# EAGLE schematic miniPET_final (EAGLE 9.6.2)

## Sheet 1 of 7
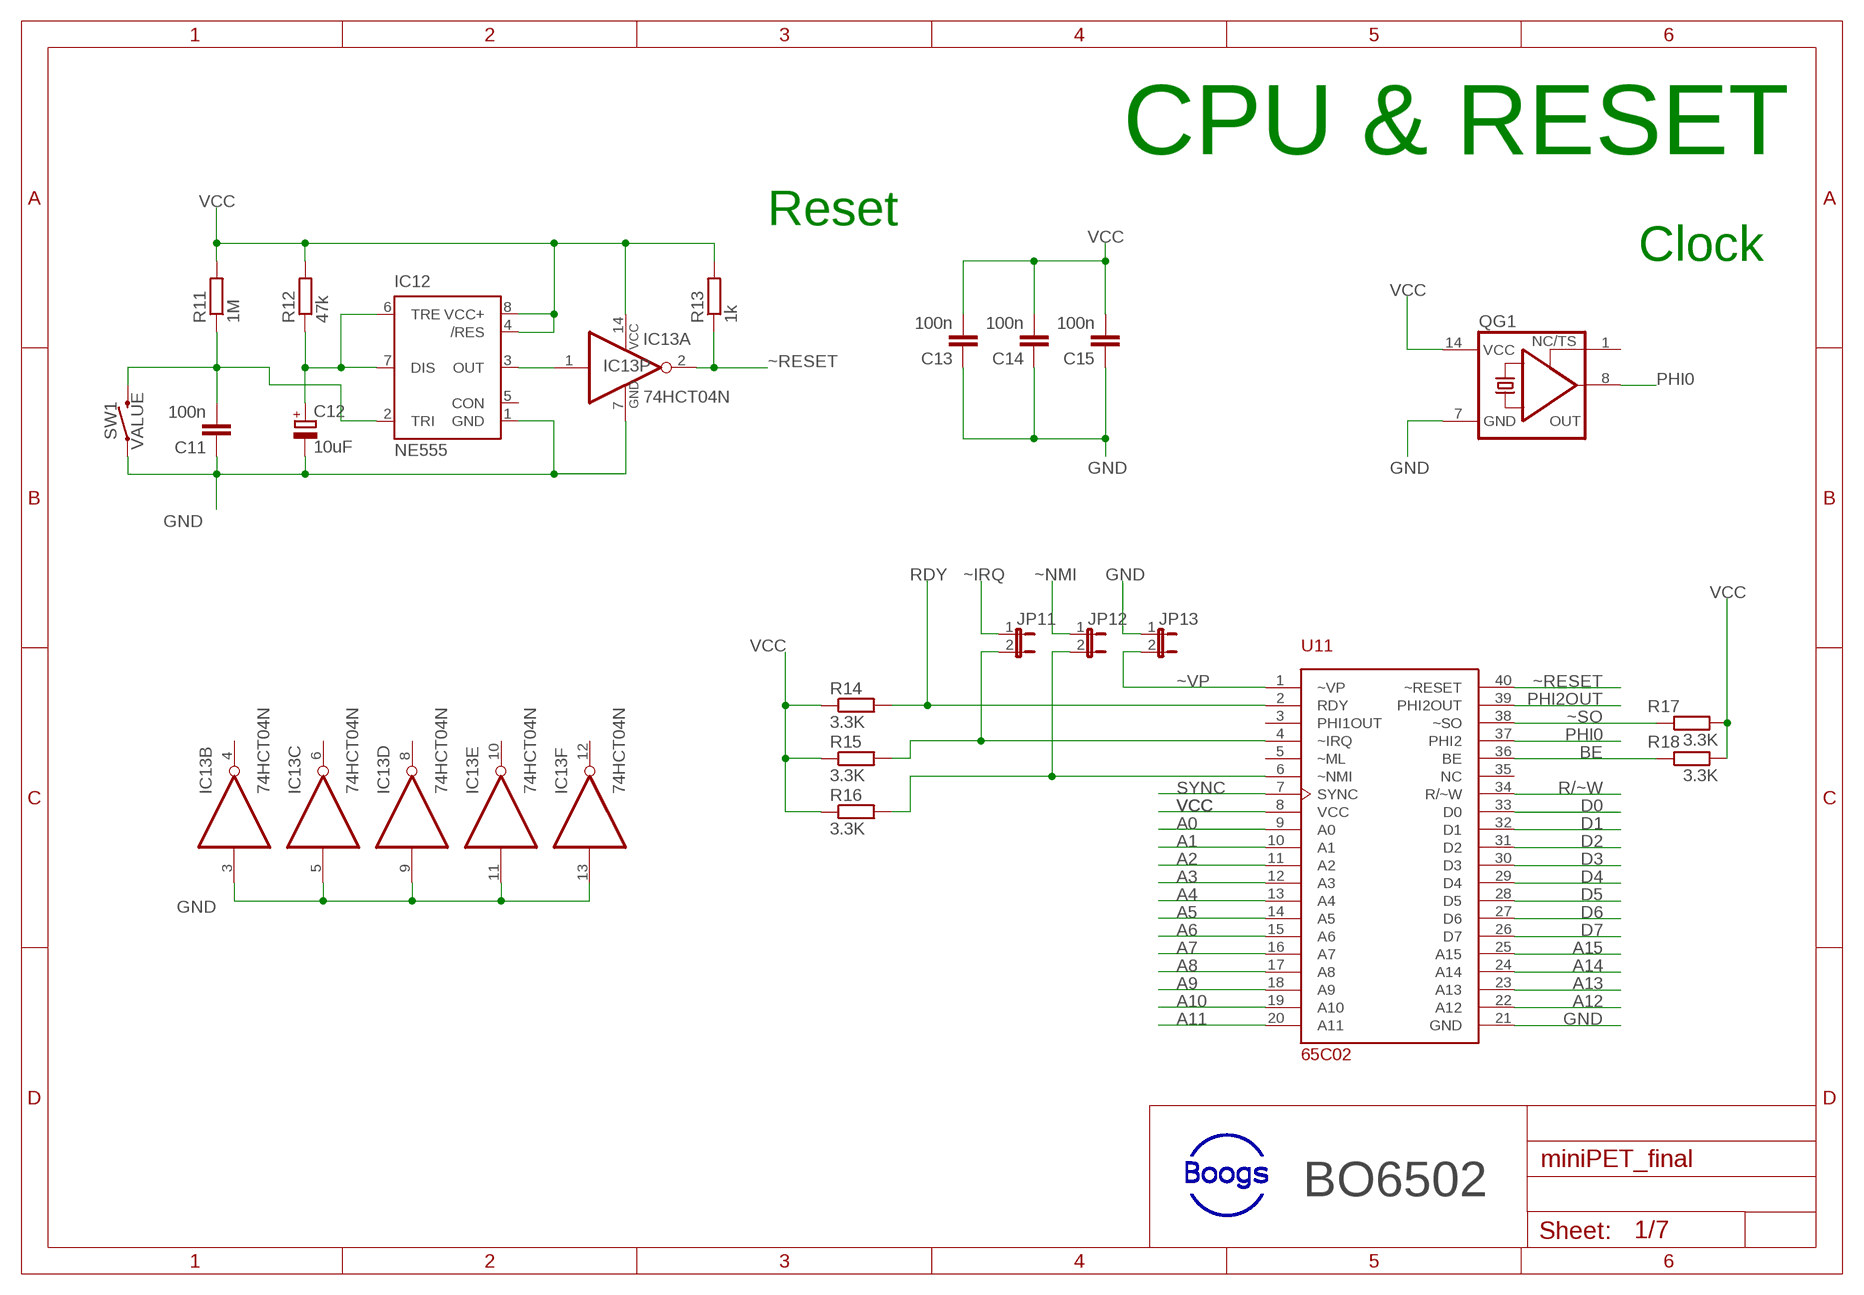
[diagram p0: schematic, sheet 1]

### Parts
C11  100n  C-EU025-025X050  [C025-025X050]
C12  10uF  CPOL-EUB45181A  [B45181A]
C13  100n  C-EU025-025X050  [C025-025X050]
C14  100n  C-EU025-025X050  [C025-025X050]
C15  100n  C-EU025-025X050  [C025-025X050]
IC12  NE555  [DIL-08]
IC13  74HCT04N  [DIL14]
JP11  JP1E  [JP1]
JP12  JP1E  [JP1]
JP13  JP1E  [JP1]
QG1  XO-14  [DIL14S]
R11  1M  R-EU_0207/10  [0207/10]
R12  47k  R-EU_0207/10  [0207/10]
R13  1k  R-EU_0207/10  [0207/10]
R14  3.3K  R-EU_0207/10  [0207/10]
R15  3.3K  R-EU_0207/10  [0207/10]
R16  3.3K  R-EU_0207/10  [0207/10]
R17  3.3K  R-EU_0207/10  [0207/10]
R18  3.3K  R-EU_0207/10  [0207/10]
SW1  MOMENTARY-SWITCH-SPST-PTH-RIGHT-ANGLE-8-020  [TACTILE_SWITCH_PTH_RA_8-020]
U11  65C02  [DIL40]

### Nets
A0: U11.9(A0) ; also sheet 2,3,4,5,6,7
A1: U11.10(A1) ; also sheet 2,3,4,5,6,7
A2: U11.11(A2) ; also sheet 2,3,5,6,7
A3: U11.12(A3) ; also sheet 2,3,5,6,7
A4: U11.13(A4) ; also sheet 2,3,5,7
A5: U11.14(A5) ; also sheet 2,3,5,7
A6: U11.15(A6) ; also sheet 2,3,5,7
A7: U11.16(A7) ; also sheet 2,3,5,7
A8: U11.17(A8) ; also sheet 2,3,5,6,7
A9: U11.18(A9) ; also sheet 2,3,5,6,7
A10: U11.19(A10) ; also sheet 2,3,5,6,7
A11: U11.20(A11) ; also sheet 2,3,5,6,7
A12: U11.22(A12) ; also sheet 2,3,4,5,7
A13: U11.23(A13) ; also sheet 2,3,4,5,7
A14: U11.24(A14) ; also sheet 2,3,4,5,6,7
A15: U11.25(A15) ; also sheet 2,3,4,5,7
BE: R18.1 U11.36(BE)
D0: U11.33(D0) ; also sheet 2,3,4,5,6,7
D1: U11.32(D1) ; also sheet 2,3,4,5,6,7
D2: U11.31(D2) ; also sheet 2,3,4,5,6,7
D3: U11.30(D3) ; also sheet 2,3,4,5,6,7
D4: U11.29(D4) ; also sheet 2,3,4,5,6,7
D5: U11.28(D5) ; also sheet 2,3,4,5,6,7
D6: U11.27(D6) ; also sheet 2,3,4,5,6,7
D7: U11.26(D7) ; also sheet 2,3,4,5,6,7
GND: C11.1 C12.- C13.1 C14.1 C15.1 IC12.1(GND) IC13.3(B:I) IC13.5(C:I) IC13.7(P:GND) IC13.9(D:I) IC13.11(E:I) IC13.13(F:I) JP13.1 QG1.7(GND) SW1.1 U11.21(GND) ; also sheet 2,3,4,5,6,7
N$2: JP11.2 R15.2 U11.4(~IRQ)
N$3: JP12.2 R16.2 U11.6(~NMI)
N$44: C12.+ IC12.6(TRE) IC12.7(DIS) R12.1
N$45: C11.2 IC12.2(TRI) R11.1 SW1.2
N$46: IC12.3(OUT) IC13.1(A:I)
PHI0: QG1.8(OUT) U11.37(PHI2) ; also sheet 2,4,5,6,7
PHI2OUT: U11.39(PHI2OUT)
R/~W: U11.34(R/~W) ; also sheet 2,4,5,6
RDY: R14.2 U11.2(RDY)
SYNC: U11.7(SYNC)
VCC: C13.2 C14.2 C15.2 IC12.4(/RES) IC12.8(VCC+) IC13.14(P:VCC) QG1.14(VCC) R11.2 R12.2 R13.2 R14.1 R15.1 R16.1 R17.2 R18.2 U11.8(VCC) ; also sheet 2,3,4,5,6,7
~IRQ: JP11.1 ; also sheet 4,5,6
~NMI: JP12.1
~RESET: IC13.2(A:O) R13.1 U11.40(~RESET) ; also sheet 4,5,6
~SO: R17.1 U11.38(~SO)
~VP: JP13.2 U11.1(~VP)
Unconnected: IC12.5(CON) IC13.4(B:O) IC13.6(C:O) IC13.8(D:O) IC13.10(E:O) IC13.12(F:O) QG1.1(TS) U11.3(PHI1OUT) U11.5(~ML) U11.35(NC)

### Notes on the sheet
- CPU & RESET
- Reset
- Clock
- BO6502

## Sheet 2 of 7
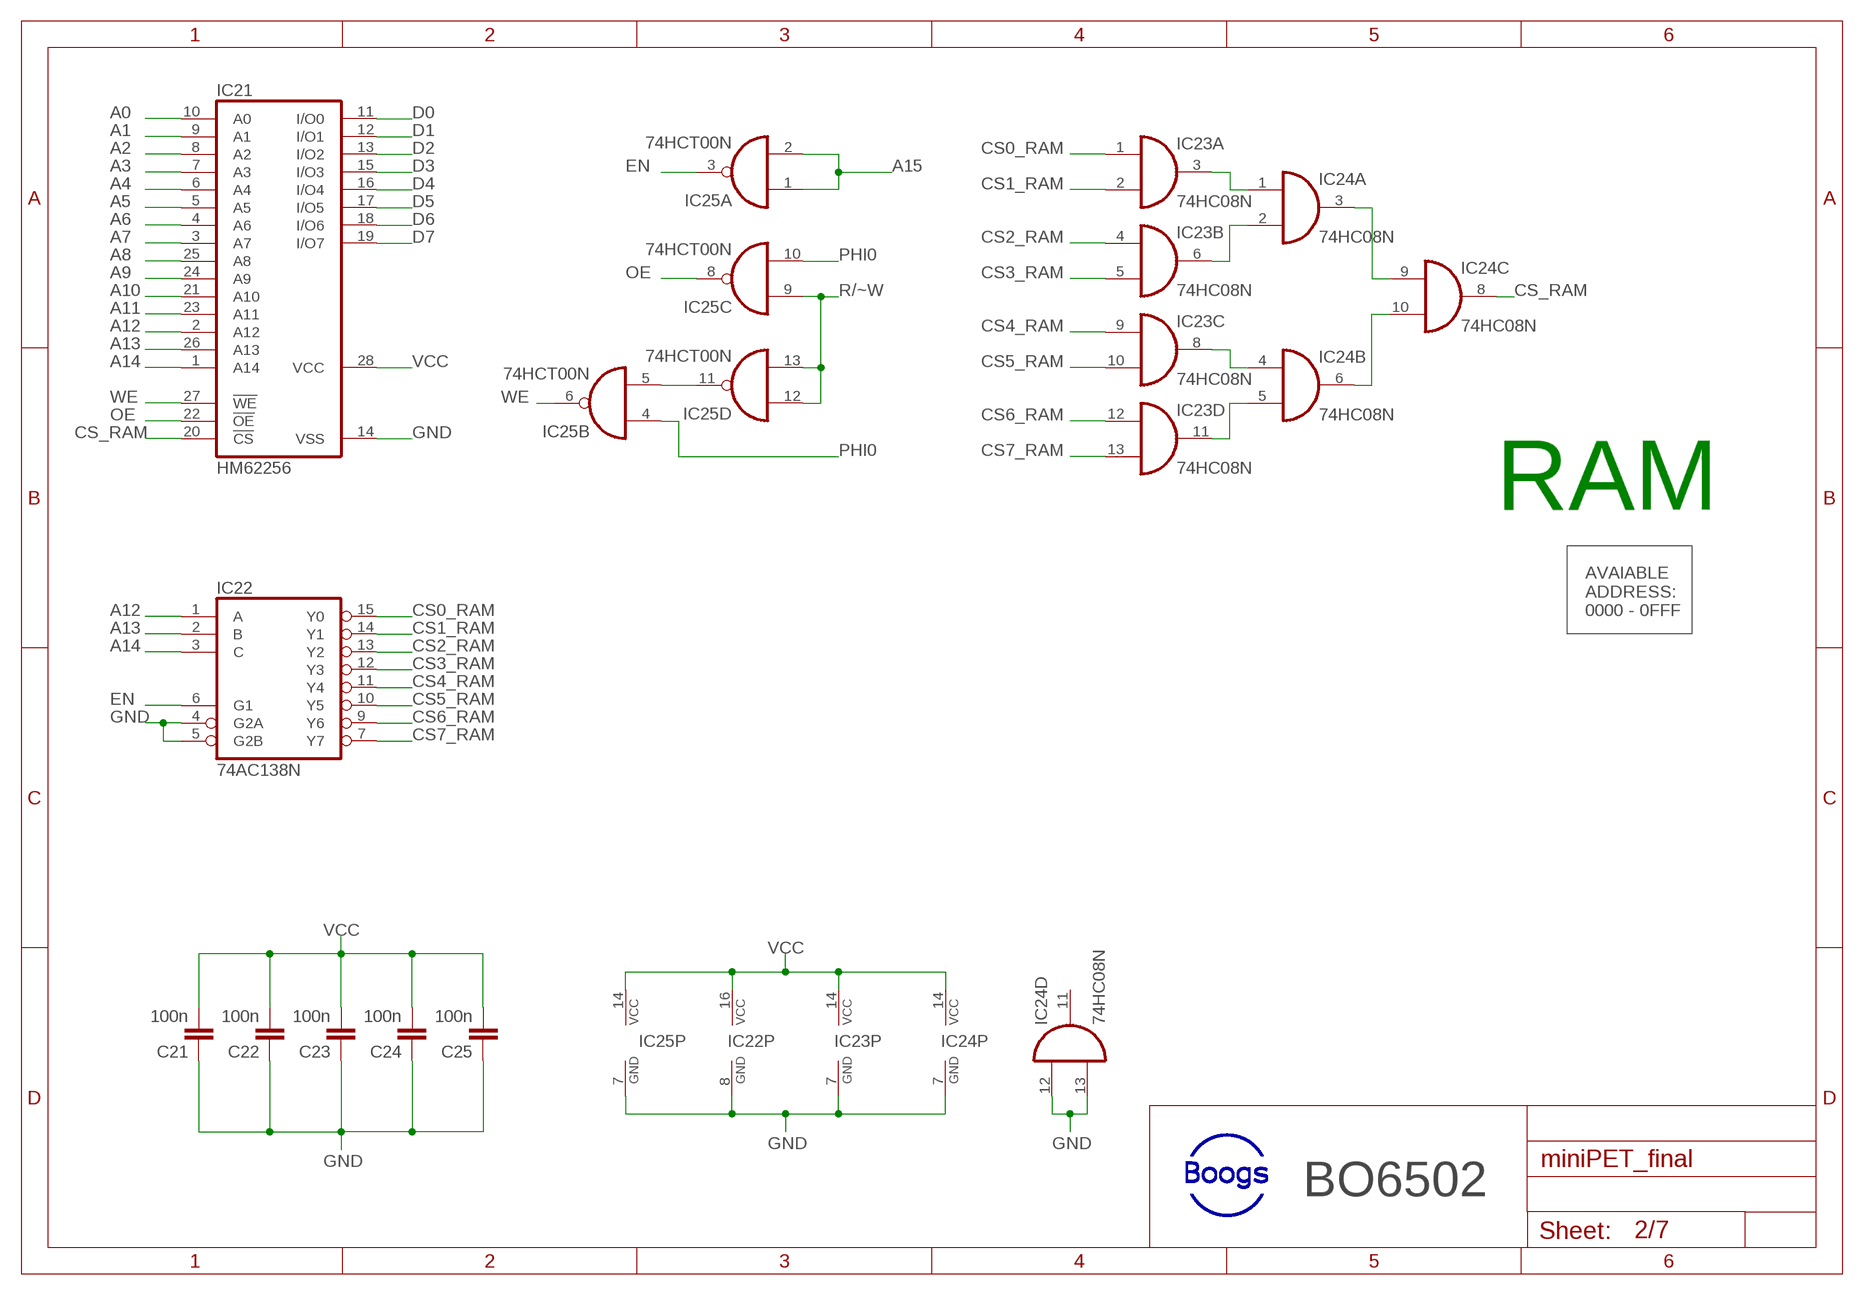
[diagram p1: schematic, sheet 2]

### Parts
C21  100n  C-EU025-025X050  [C025-025X050]
C22  100n  C-EU025-025X050  [C025-025X050]
C23  100n  C-EU025-025X050  [C025-025X050]
C24  100n  C-EU025-025X050  [C025-025X050]
C25  100n  C-EU025-025X050  [C025-025X050]
IC21  HM62256  62256P  [DIL28-6]
IC22  74AC138N  [DIL16]
IC23  74HC08N  [DIL14]
IC24  74HC08N  [DIL14]
IC25  74HCT00N  [DIL14]

### Nets
A0: IC21.10(A0) ; also sheet 1,3,4,5,6,7
A1: IC21.9(A1) ; also sheet 1,3,4,5,6,7
A2: IC21.8(A2) ; also sheet 1,3,5,6,7
A3: IC21.7(A3) ; also sheet 1,3,5,6,7
A4: IC21.6(A4) ; also sheet 1,3,5,7
A5: IC21.5(A5) ; also sheet 1,3,5,7
A6: IC21.4(A6) ; also sheet 1,3,5,7
A7: IC21.3(A7) ; also sheet 1,3,5,7
A8: IC21.25(A8) ; also sheet 1,3,5,6,7
A9: IC21.24(A9) ; also sheet 1,3,5,6,7
A10: IC21.21(A10) ; also sheet 1,3,5,6,7
A11: IC21.23(A11) ; also sheet 1,3,5,6,7
A12: IC21.2(A12) IC22.1(A) ; also sheet 1,3,4,5,7
A13: IC21.26(A13) IC22.2(B) ; also sheet 1,3,4,5,7
A14: IC21.1(A14) IC22.3(C) ; also sheet 1,3,4,5,6,7
A15: IC25.1(A:I0) IC25.2(A:I1) ; also sheet 1,3,4,5,7
CS0_RAM: IC22.15(Y0) IC23.1(A:I0)
CS1_RAM: IC22.14(Y1) IC23.2(A:I1)
CS2_RAM: IC22.13(Y2) IC23.4(B:I0)
CS3_RAM: IC22.12(Y3) IC23.5(B:I1)
CS4_RAM: IC22.11(Y4) IC23.9(C:I0)
CS5_RAM: IC22.10(Y5) IC23.10(C:I1)
CS6_RAM: IC22.9(Y6) IC23.12(D:I0)
CS7_RAM: IC22.7(Y7) IC23.13(D:I1)
CS_RAM: IC21.20(!CS) IC24.8(C:O)
D0: IC21.11(I/O0) ; also sheet 1,3,4,5,6,7
D1: IC21.12(I/O1) ; also sheet 1,3,4,5,6,7
D2: IC21.13(I/O2) ; also sheet 1,3,4,5,6,7
D3: IC21.15(I/O3) ; also sheet 1,3,4,5,6,7
D4: IC21.16(I/O4) ; also sheet 1,3,4,5,6,7
D5: IC21.17(I/O5) ; also sheet 1,3,4,5,6,7
D6: IC21.18(I/O6) ; also sheet 1,3,4,5,6,7
D7: IC21.19(I/O7) ; also sheet 1,3,4,5,6,7
EN: IC22.6(G1) IC25.3(A:O)
GND: C21.1 C22.1 C23.1 C24.1 C25.1 IC21.14(VSS) IC22.4(G2A) IC22.5(G2B) IC22.8(GND) IC23.7(P:GND) IC24.7(P:GND) IC24.12(D:I0) IC24.13(D:I1) IC25.7(P:GND) ; also sheet 1,3,4,5,6,7
N$10: IC25.5(B:I1) IC25.11(D:O)
N$12: IC23.3(A:O) IC24.1(A:I0)
N$13: IC23.6(B:O) IC24.2(A:I1)
N$14: IC23.8(C:O) IC24.4(B:I0)
N$15: IC23.11(D:O) IC24.5(B:I1)
N$16: IC24.3(A:O) IC24.9(C:I0)
N$17: IC24.6(B:O) IC24.10(C:I1)
OE: IC21.22(!OE) IC25.8(C:O)
PHI0: IC25.4(B:I0) IC25.10(C:I1) ; also sheet 1,4,5,6,7
R/~W: IC25.9(C:I0) IC25.12(D:I0) IC25.13(D:I1) ; also sheet 1,4,5,6
VCC: C21.2 C22.2 C23.2 C24.2 C25.2 IC21.28(VCC) IC22.16(VCC) IC23.14(P:VCC) IC24.14(P:VCC) IC25.14(P:VCC) ; also sheet 1,3,4,5,6,7
WE: IC21.27(!WE) IC25.6(B:O)
Unconnected: IC24.11(D:O)

### Notes on the sheet
- RAM
- AVAIABLE 
  ADDRESS:
  0000 - 0FFF
- BO6502

## Sheet 3 of 7
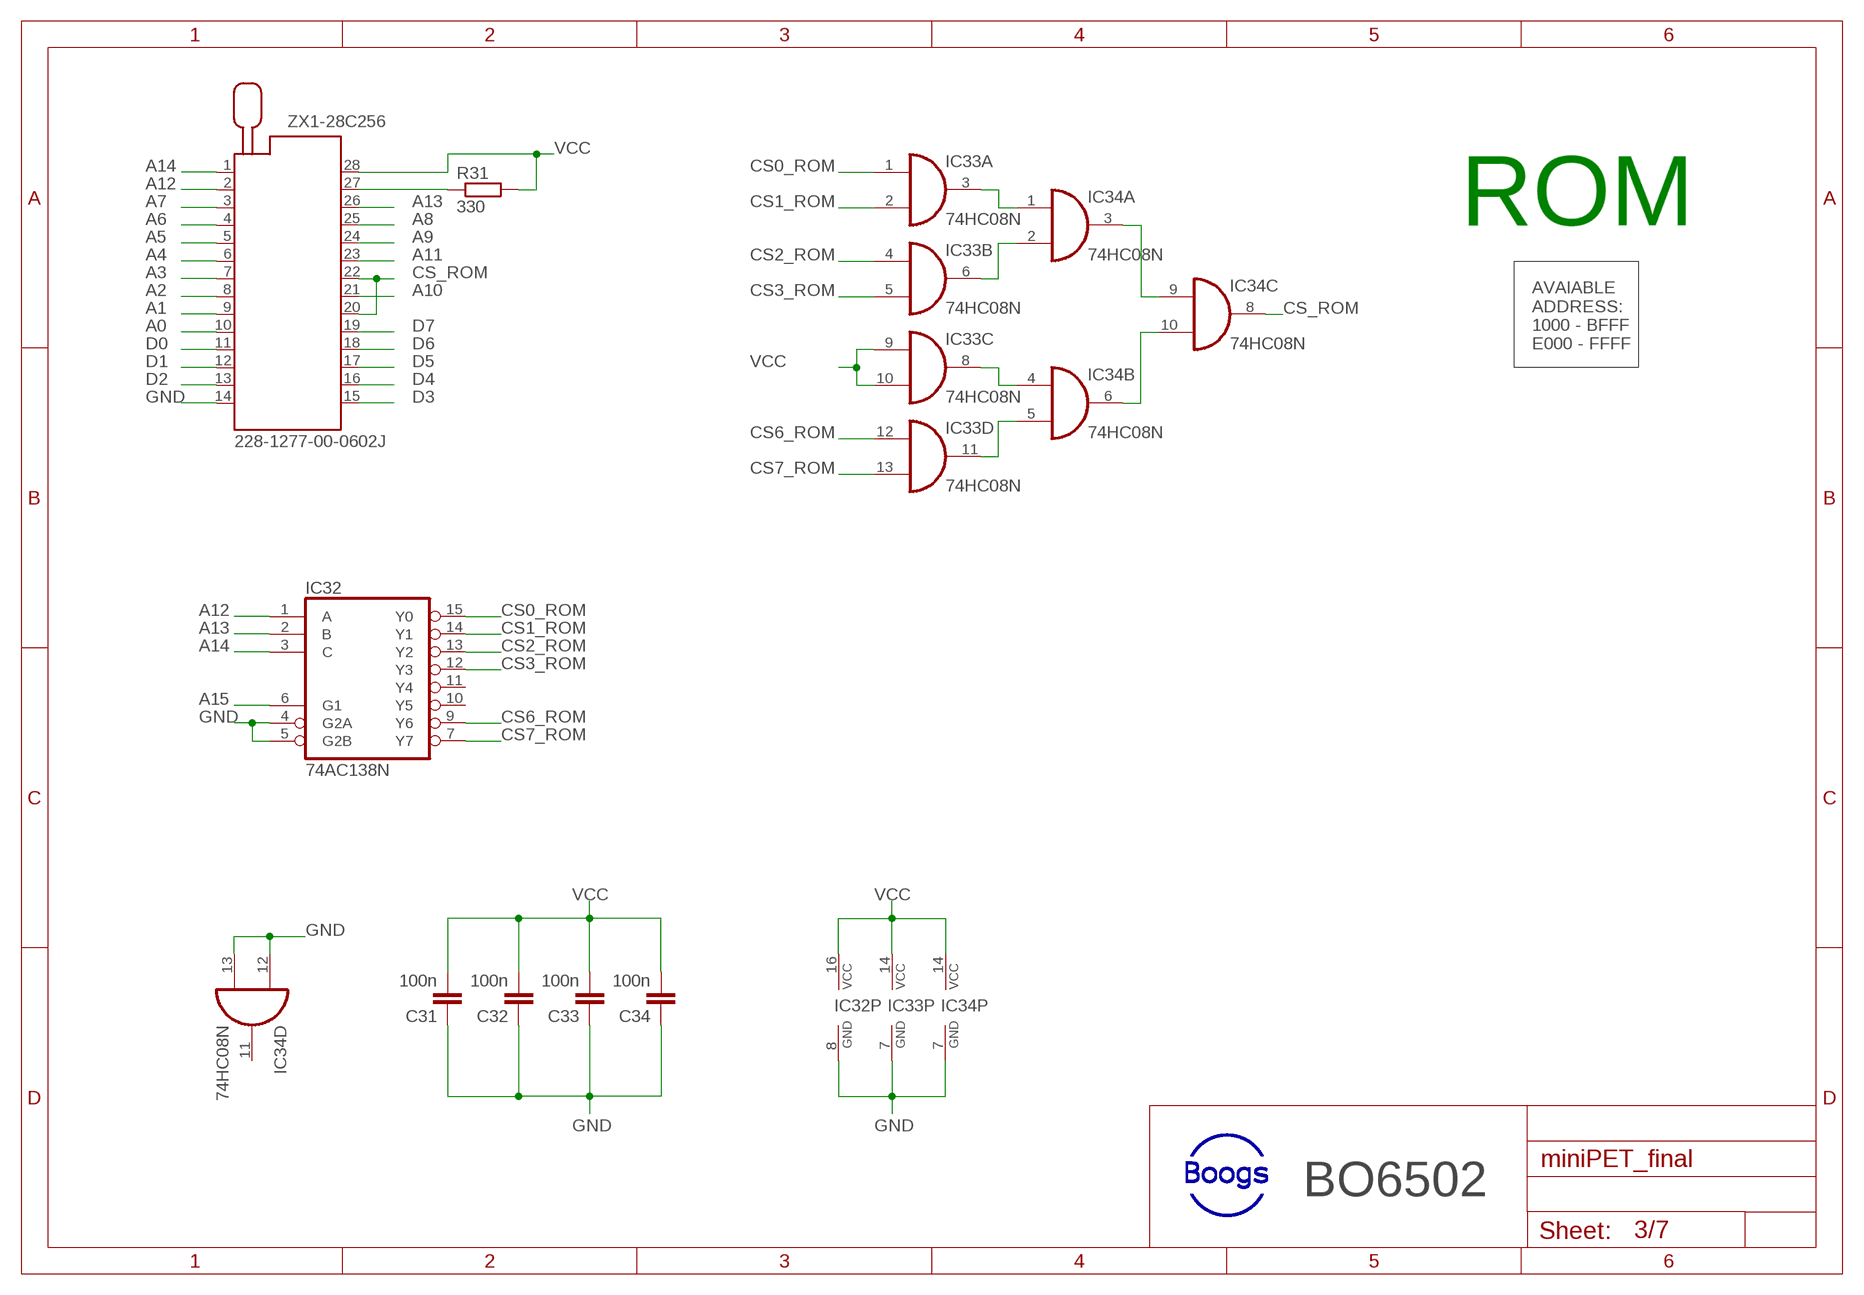
[diagram p2: schematic, sheet 3]

### Parts
C31  100n  C-EU025-025X050  [C025-025X050]
C32  100n  C-EU025-025X050  [C025-025X050]
C33  100n  C-EU025-025X050  [C025-025X050]
C34  100n  C-EU025-025X050  [C025-025X050]
IC32  74AC138N  [DIL16]
IC33  74HC08N  [DIL14]
IC34  74HC08N  [DIL14]
R31  330  R-EU_0207/10  [0207/10]
ZX1-28C256  228-1277-00-0602J  [228-1277-00-0602J]

### Nets
A0: ZX1-28C256.10 ; also sheet 1,2,4,5,6,7
A1: ZX1-28C256.9 ; also sheet 1,2,4,5,6,7
A2: ZX1-28C256.8 ; also sheet 1,2,5,6,7
A3: ZX1-28C256.7 ; also sheet 1,2,5,6,7
A4: ZX1-28C256.6 ; also sheet 1,2,5,7
A5: ZX1-28C256.5 ; also sheet 1,2,5,7
A6: ZX1-28C256.4 ; also sheet 1,2,5,7
A7: ZX1-28C256.3 ; also sheet 1,2,5,7
A8: ZX1-28C256.25 ; also sheet 1,2,5,6,7
A9: ZX1-28C256.24 ; also sheet 1,2,5,6,7
A10: ZX1-28C256.21 ; also sheet 1,2,5,6,7
A11: ZX1-28C256.23 ; also sheet 1,2,5,6,7
A12: IC32.1(A) ZX1-28C256.2 ; also sheet 1,2,4,5,7
A13: IC32.2(B) ZX1-28C256.26 ; also sheet 1,2,4,5,7
A14: IC32.3(C) ZX1-28C256.1 ; also sheet 1,2,4,5,6,7
A15: IC32.6(G1) ; also sheet 1,2,4,5,7
CS0_ROM: IC32.15(Y0) IC33.1(A:I0)
CS1_ROM: IC32.14(Y1) IC33.2(A:I1)
CS2_ROM: IC32.13(Y2) IC33.4(B:I0)
CS3_ROM: IC32.12(Y3) IC33.5(B:I1)
CS6_ROM: IC32.9(Y6) IC33.12(D:I0)
CS7_ROM: IC32.7(Y7) IC33.13(D:I1)
CS_ROM: IC34.8(C:O) ZX1-28C256.20 ZX1-28C256.22
D0: ZX1-28C256.11 ; also sheet 1,2,4,5,6,7
D1: ZX1-28C256.12 ; also sheet 1,2,4,5,6,7
D2: ZX1-28C256.13 ; also sheet 1,2,4,5,6,7
D3: ZX1-28C256.15 ; also sheet 1,2,4,5,6,7
D4: ZX1-28C256.16 ; also sheet 1,2,4,5,6,7
D5: ZX1-28C256.17 ; also sheet 1,2,4,5,6,7
D6: ZX1-28C256.18 ; also sheet 1,2,4,5,6,7
D7: ZX1-28C256.19 ; also sheet 1,2,4,5,6,7
GND: C31.1 C32.1 C33.1 C34.1 IC32.4(G2A) IC32.5(G2B) IC32.8(GND) IC33.7(P:GND) IC34.7(P:GND) IC34.12(D:I0) IC34.13(D:I1) ZX1-28C256.14 ; also sheet 1,2,4,5,6,7
N$1: R31.1 ZX1-28C256.27
N$28: IC33.3(A:O) IC34.1(A:I0)
N$29: IC33.6(B:O) IC34.2(A:I1)
N$30: IC33.8(C:O) IC34.4(B:I0)
N$31: IC33.11(D:O) IC34.5(B:I1)
N$32: IC34.3(A:O) IC34.9(C:I0)
N$33: IC34.6(B:O) IC34.10(C:I1)
VCC: C31.2 C32.2 C33.2 C34.2 IC32.16(VCC) IC33.9(C:I0) IC33.10(C:I1) IC33.14(P:VCC) IC34.14(P:VCC) R31.2 ZX1-28C256.28 ; also sheet 1,2,4,5,6,7
Unconnected: IC32.10(Y5) IC32.11(Y4) IC34.11(D:O)

### Notes on the sheet
- ROM
- AVAIABLE 
  ADDRESS:
  1000 - BFFF
  E000 - FFFF
- BO6502

## Sheet 4 of 7
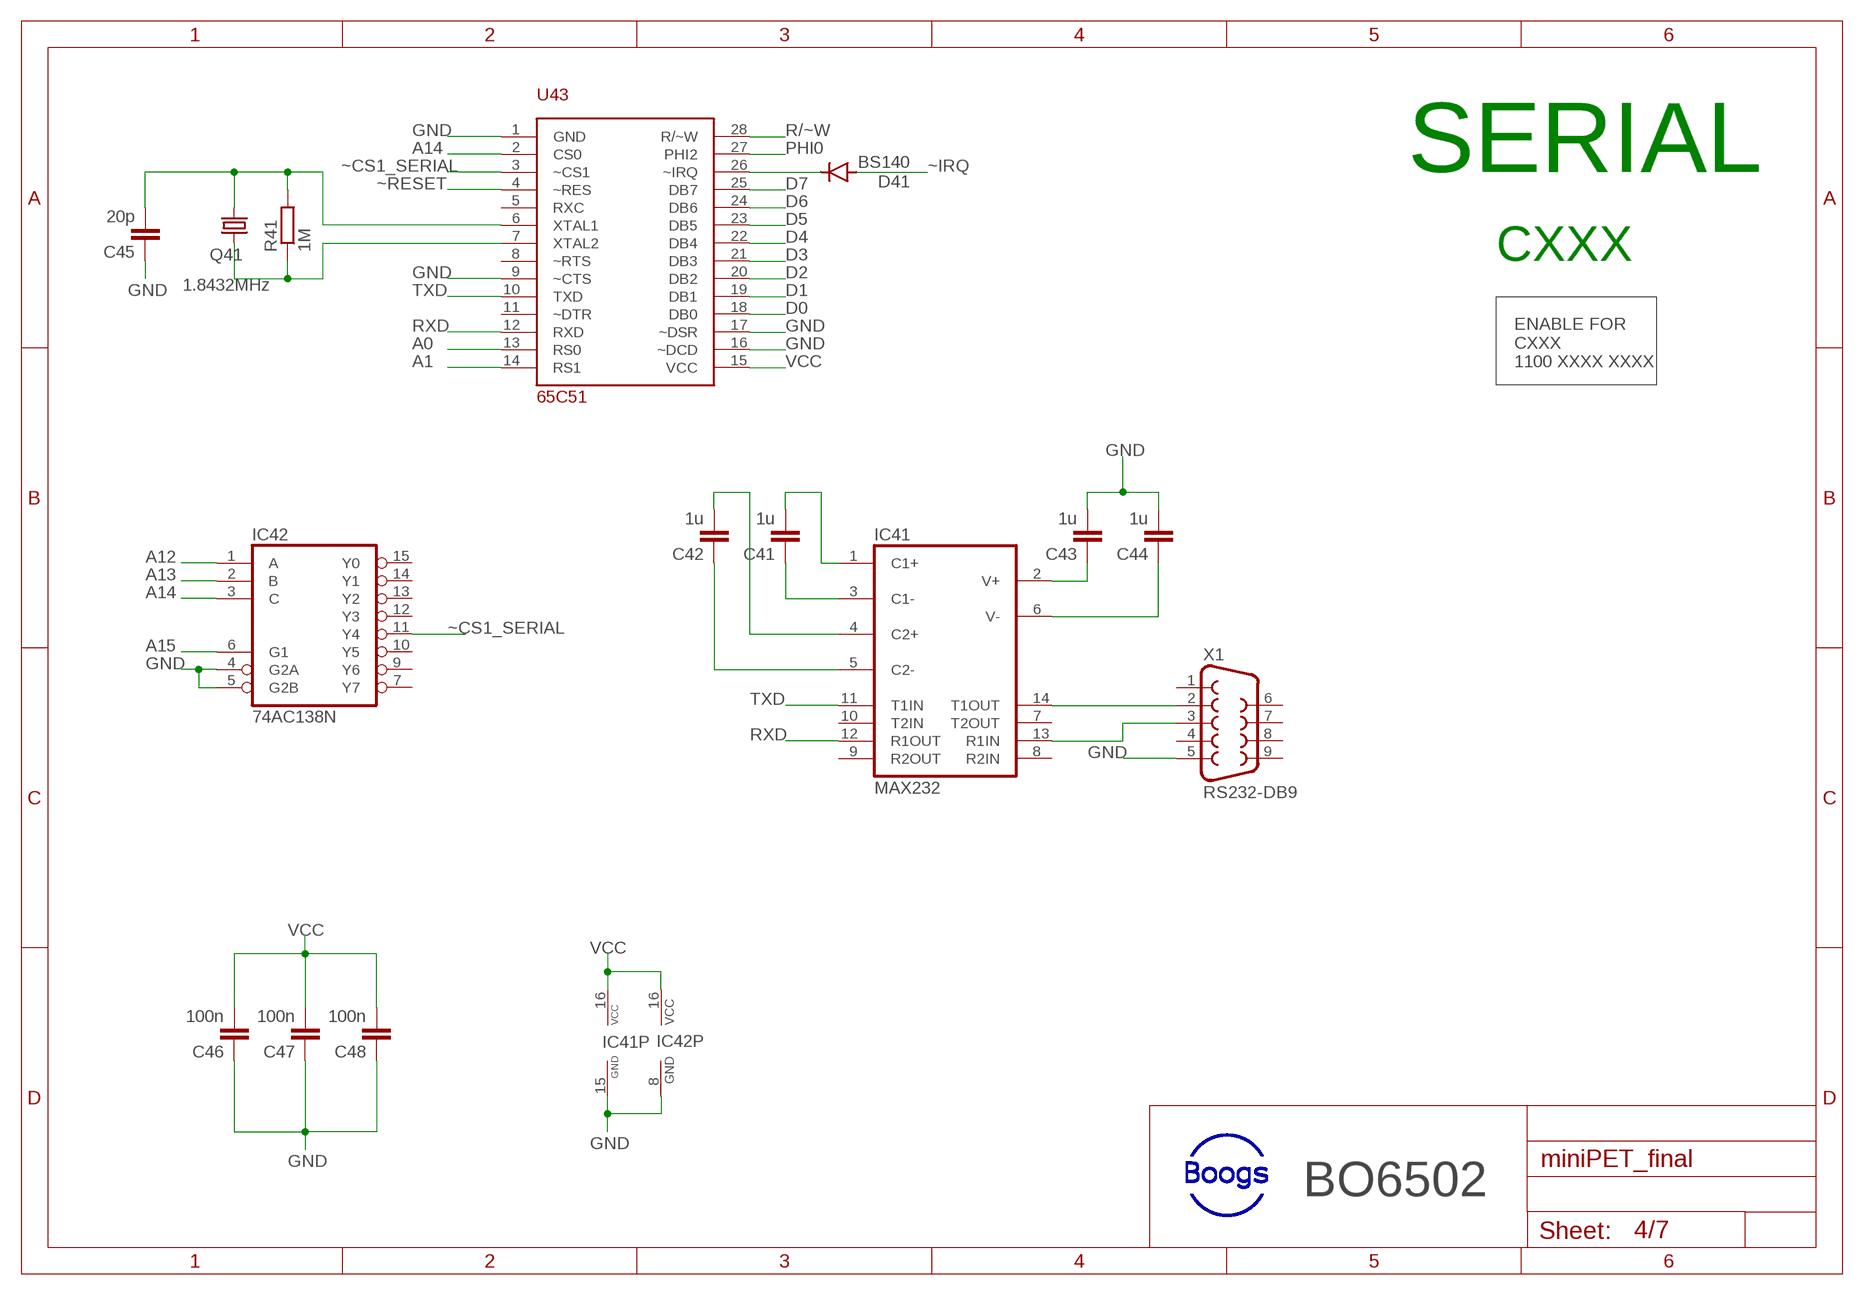
[diagram p3: schematic, sheet 4]

### Parts
C41  1u  C-EU050-025X075  [C050-025X075]
C42  1u  C-EU050-025X075  [C050-025X075]
C43  1u  C-EU050-025X075  [C050-025X075]
C44  1u  C-EU050-025X075  [C050-025X075]
C45  20p  C-EU025-025X050  [C025-025X050]
C46  100n  C-EU025-025X050  [C025-025X050]
C47  100n  C-EU025-025X050  [C025-025X050]
C48  100n  C-EU025-025X050  [C025-025X050]
D41  BS140  1N4004  [DO41-10]
IC41  MAX232  [DIL16]
IC42  74AC138N  [DIL16]
Q41  1.8432MHz  CRYSTALHC49S  [HC49/S]
R41  1M  R-EU_0207/10  [0207/10]
U43  65C51  [DIL28]
X1  RS232-DB9  F09HP  [F09HP]

### Nets
A0: U43.13(RS0) ; also sheet 1,2,3,5,6,7
A1: U43.14(RS1) ; also sheet 1,2,3,5,6,7
A12: IC42.1(A) ; also sheet 1,2,3,5,7
A13: IC42.2(B) ; also sheet 1,2,3,5,7
A14: IC42.3(C) U43.2(CS0) ; also sheet 1,2,3,5,6,7
A15: IC42.6(G1) ; also sheet 1,2,3,5,7
D0: U43.18(DB0) ; also sheet 1,2,3,5,6,7
D1: U43.19(DB1) ; also sheet 1,2,3,5,6,7
D2: U43.20(DB2) ; also sheet 1,2,3,5,6,7
D3: U43.21(DB3) ; also sheet 1,2,3,5,6,7
D4: U43.22(DB4) ; also sheet 1,2,3,5,6,7
D5: U43.23(DB5) ; also sheet 1,2,3,5,6,7
D6: U43.24(DB6) ; also sheet 1,2,3,5,6,7
D7: U43.25(DB7) ; also sheet 1,2,3,5,6,7
GND: C43.2 C44.2 C45.1 C46.1 C47.1 C48.1 IC41.15(GND) IC42.4(G2A) IC42.5(G2B) IC42.8(GND) U43.1(GND) U43.9(~CTS) U43.16(~DCD) U43.17(~DSR) X1.5 ; also sheet 1,2,3,5,6,7
N$26: D41.C U43.26(~IRQ)
N$42: C41.2 IC41.1(C1+)
N$43: C41.1 IC41.3(C1-)
N$47: C42.1 IC41.5(C2-)
N$48: IC41.14(T1OUT) X1.2
N$49: IC41.13(R1IN) X1.3
N$50: C43.1 IC41.2(V+)
N$51: C44.1 IC41.6(V-)
N$52: C42.2 IC41.4(C2+)
N$53: C45.2 Q41.2 R41.2 U43.6(XTAL1)
N$54: Q41.1 R41.1 U43.7(XTAL2)
PHI0: U43.27(PHI2) ; also sheet 1,2,5,6,7
R/~W: U43.28(R/~W) ; also sheet 1,2,5,6
RXD: IC41.12(R1OUT) U43.12(RXD)
TXD: IC41.11(T1IN) U43.10(TXD)
VCC: C46.2 C47.2 C48.2 IC41.16(VCC) IC42.16(VCC) U43.15(VCC) ; also sheet 1,2,3,5,6,7
~CS1_SERIAL: IC42.11(Y4) U43.3(~CS1)
~IRQ: D41.A ; also sheet 1,5,6
~RESET: U43.4(~RES) ; also sheet 1,5,6
Unconnected: IC41.7(T2OUT) IC41.8(R2IN) IC41.9(R2OUT) IC41.10(T2IN) IC42.7(Y7) IC42.9(Y6) IC42.10(Y5) IC42.12(Y3) IC42.13(Y2) IC42.14(Y1) IC42.15(Y0) U43.5(RXC) U43.8(~RTS) U43.11(~DTR) X1.1 X1.4 X1.6 X1.7 X1.8 X1.9

### Notes on the sheet
- SERIAL
- CXXX
- ENABLE FOR
  CXXX
  1100 XXXX XXXX
- BO6502

## Sheet 5 of 7
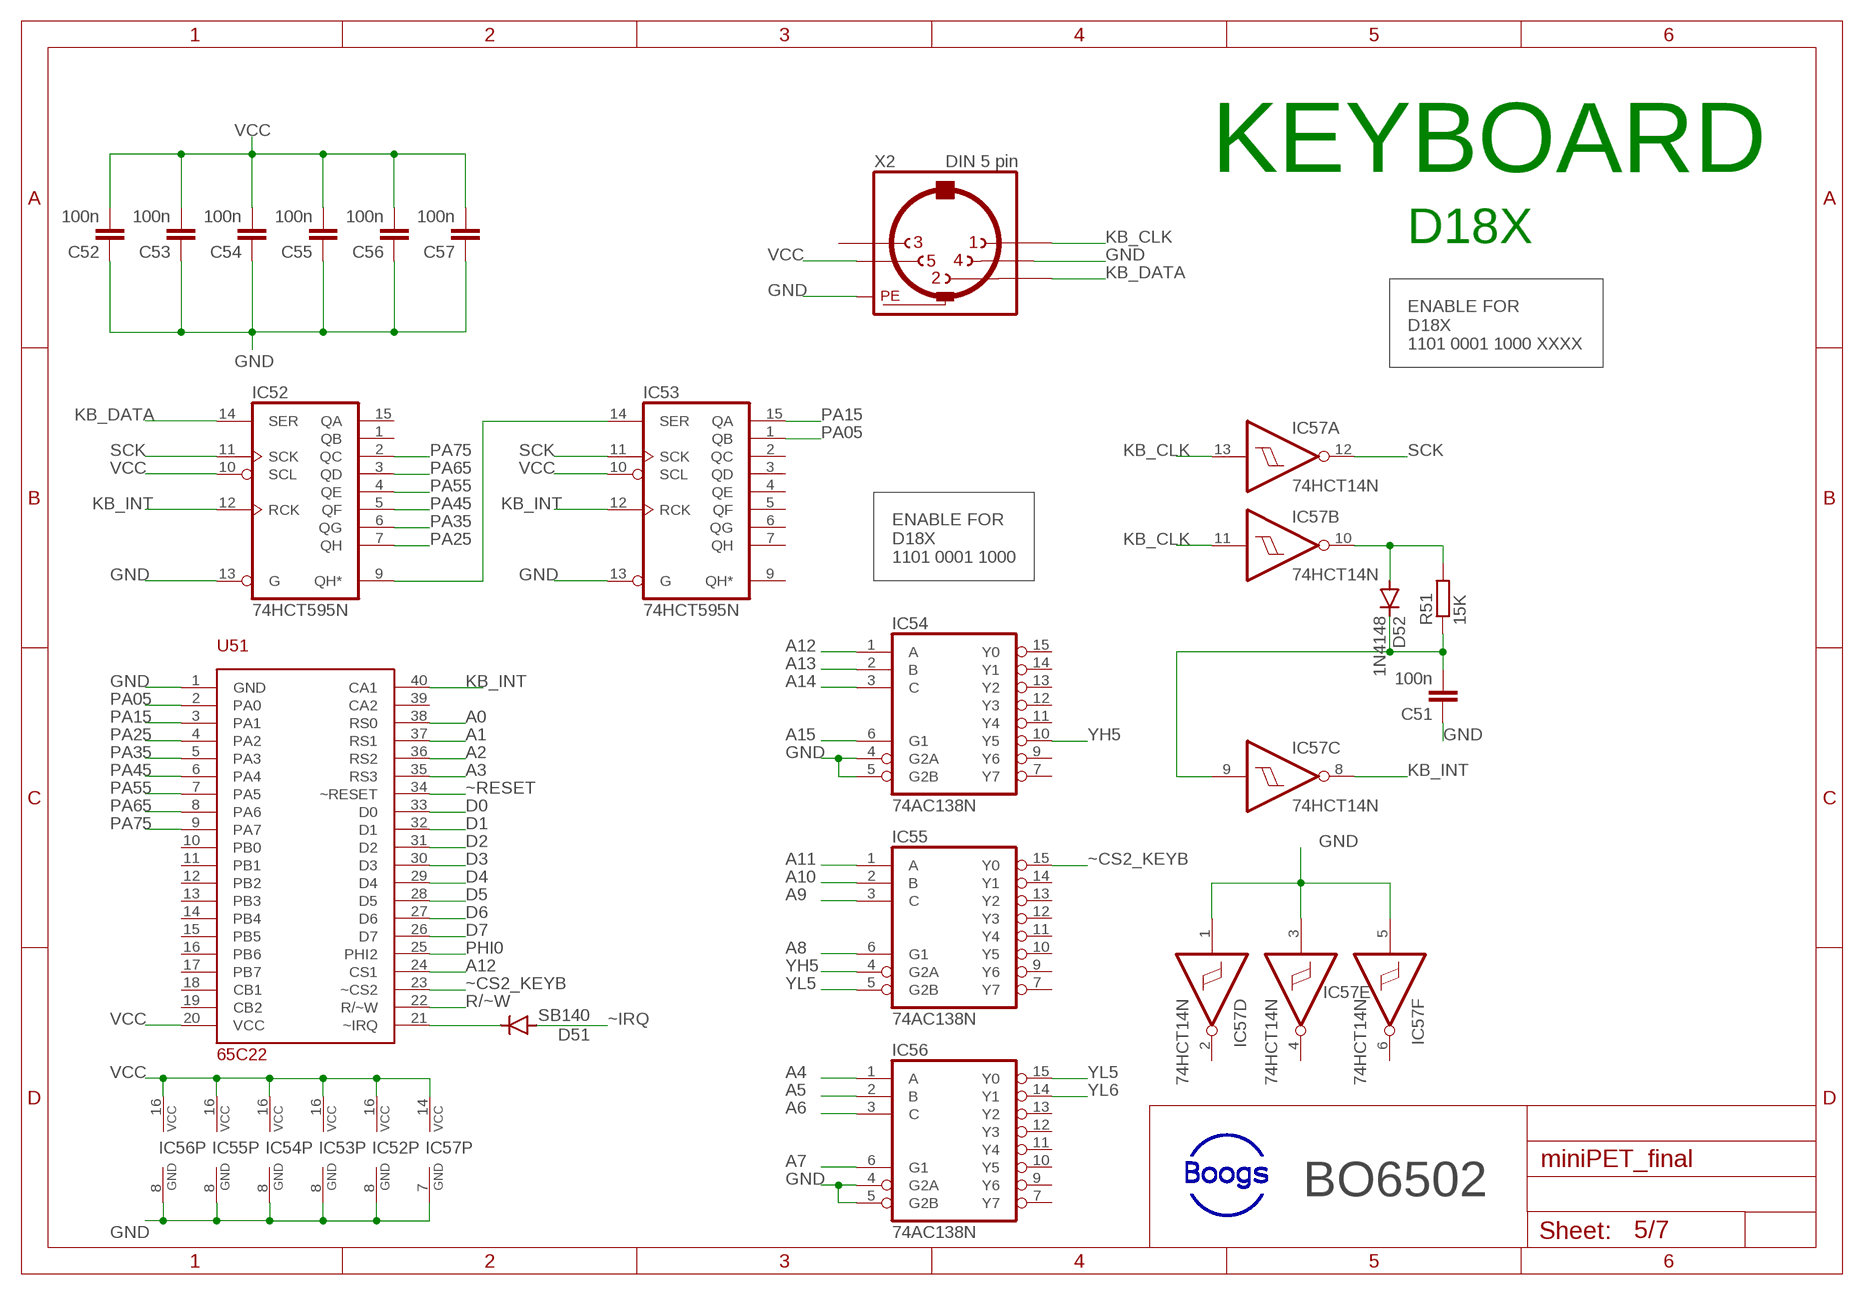
[diagram p4: schematic, sheet 5]

### Parts
C51  100n  C-EU025-025X050  [C025-025X050]
C52  100n  C-EU025-025X050  [C025-025X050]
C53  100n  C-EU025-025X050  [C025-025X050]
C54  100n  C-EU025-025X050  [C025-025X050]
C55  100n  C-EU025-025X050  [C025-025X050]
C56  100n  C-EU025-025X050  [C025-025X050]
C57  100n  C-EU025-025X050  [C025-025X050]
D51  SB140  1N4004  [DO41-10]
D52  1N4148  1N4148DO35-7  [DO35-7]
IC52  74HCT595N  [DIL16]
IC53  74HCT595N  [DIL16]
IC54  74AC138N  [DIL16]
IC55  74AC138N  [DIL16]
IC56  74AC138N  [DIL16]
IC57  74HCT14N  [DIL14]
R51  15K  R-EU_0207/10  [0207/10]
U51  65C22  [DIL40]
X2  DIN 5 pin  MAB5SH  [MAB5SH]

### Nets
A0: U51.38(RS0) ; also sheet 1,2,3,4,6,7
A1: U51.37(RS1) ; also sheet 1,2,3,4,6,7
A2: U51.36(RS2) ; also sheet 1,2,3,6,7
A3: U51.35(RS3) ; also sheet 1,2,3,6,7
A4: IC56.1(A) ; also sheet 1,2,3,7
A5: IC56.2(B) ; also sheet 1,2,3,7
A6: IC56.3(C) ; also sheet 1,2,3,7
A7: IC56.6(G1) ; also sheet 1,2,3,7
A8: IC55.6(G1) ; also sheet 1,2,3,6,7
A9: IC55.3(C) ; also sheet 1,2,3,6,7
A10: IC55.2(B) ; also sheet 1,2,3,6,7
A11: IC55.1(A) ; also sheet 1,2,3,6,7
A12: IC54.1(A) U51.24(CS1) ; also sheet 1,2,3,4,7
A13: IC54.2(B) ; also sheet 1,2,3,4,7
A14: IC54.3(C) ; also sheet 1,2,3,4,6,7
A15: IC54.6(G1) ; also sheet 1,2,3,4,7
D0: U51.33(D0) ; also sheet 1,2,3,4,6,7
D1: U51.32(D1) ; also sheet 1,2,3,4,6,7
D2: U51.31(D2) ; also sheet 1,2,3,4,6,7
D3: U51.30(D3) ; also sheet 1,2,3,4,6,7
D4: U51.29(D4) ; also sheet 1,2,3,4,6,7
D5: U51.28(D5) ; also sheet 1,2,3,4,6,7
D6: U51.27(D6) ; also sheet 1,2,3,4,6,7
D7: U51.26(D7) ; also sheet 1,2,3,4,6,7
GND: C51.1 C52.1 C53.1 C54.1 C55.1 C56.1 C57.1 IC52.8(GND) IC52.13(G) IC53.8(GND) IC53.13(G) IC54.4(G2A) IC54.5(G2B) IC54.8(GND) IC55.8(GND) IC56.4(G2A) IC56.5(G2B) IC56.8(GND) IC57.1(D:I) IC57.3(E:I) IC57.5(F:I) IC57.7(P:GND) U51.1(GND) X2.4 X2.PE X2.PE@(PE) ; also sheet 1,2,3,4,6,7
KB_CLK: IC57.11(B:I) IC57.13(A:I) X2.1
KB_DATA: IC52.14(SER) X2.2
KB_INT: IC52.12(RCK) IC53.12(RCK) IC57.8(C:O) U51.40(CA1)
N$55: D51.C U51.21(~IRQ)
N$56: IC52.9(QH*) IC53.14(SER)
N$57: D52.A IC57.10(B:O) R51.2
N$58: C51.2 D52.C IC57.9(C:I) R51.1
PA05: IC53.1(QB) U51.2(PA0)
PA15: IC53.15(QA) U51.3(PA1)
PA25: IC52.7(QH) U51.4(PA2)
PA35: IC52.6(QG) U51.5(PA3)
PA45: IC52.5(QF) U51.6(PA4)
PA55: IC52.4(QE) U51.7(PA5)
PA65: IC52.3(QD) U51.8(PA6)
PA75: IC52.2(QC) U51.9(PA7)
PHI0: U51.25(PHI2) ; also sheet 1,2,4,6,7
R/~W: U51.22(R/~W) ; also sheet 1,2,4,6
SCK: IC52.11(SCK) IC53.11(SCK) IC57.12(A:O)
VCC: C52.2 C53.2 C54.2 C55.2 C56.2 C57.2 IC52.10(SCL) IC52.16(VCC) IC53.10(SCL) IC53.16(VCC) IC54.16(VCC) IC55.16(VCC) IC56.16(VCC) IC57.14(P:VCC) U51.20(VCC) X2.5 ; also sheet 1,2,3,4,6,7
YH5: IC54.10(Y5) IC55.4(G2A) ; also sheet 6
YL5: IC55.5(G2B) IC56.15(Y0)
YL6: IC56.14(Y1) ; also sheet 6
~CS2_KEYB: IC55.15(Y0) U51.23(~CS2)
~IRQ: D51.A ; also sheet 1,4,6
~RESET: U51.34(~RESET) ; also sheet 1,4,6
Unconnected: IC52.1(QB) IC52.15(QA) IC53.2(QC) IC53.3(QD) IC53.4(QE) IC53.5(QF) IC53.6(QG) IC53.7(QH) IC53.9(QH*) IC54.7(Y7) IC54.9(Y6) IC54.11(Y4) IC54.12(Y3) IC54.13(Y2) IC54.14(Y1) IC54.15(Y0) IC55.7(Y7) IC55.9(Y6) IC55.10(Y5) IC55.11(Y4) IC55.12(Y3) IC55.13(Y2) IC55.14(Y1) IC56.7(Y7) IC56.9(Y6) IC56.10(Y5) IC56.11(Y4) IC56.12(Y3) IC56.13(Y2) IC57.2(D:O) IC57.4(E:O) IC57.6(F:O) U51.10(PB0) U51.11(PB1) U51.12(PB2) U51.13(PB3) U51.14(PB4) U51.15(PB5) U51.16(PB6) U51.17(PB7) U51.18(CB1) U51.19(CB2) U51.39(CA2) X2.3

### Notes on the sheet
- KEYBOARD
- D18X
- ENABLE FOR
  D18X
  1101 0001 1000 XXXX
- ENABLE FOR
  D18X
  1101 0001 1000
- BO6502

## Sheet 6 of 7
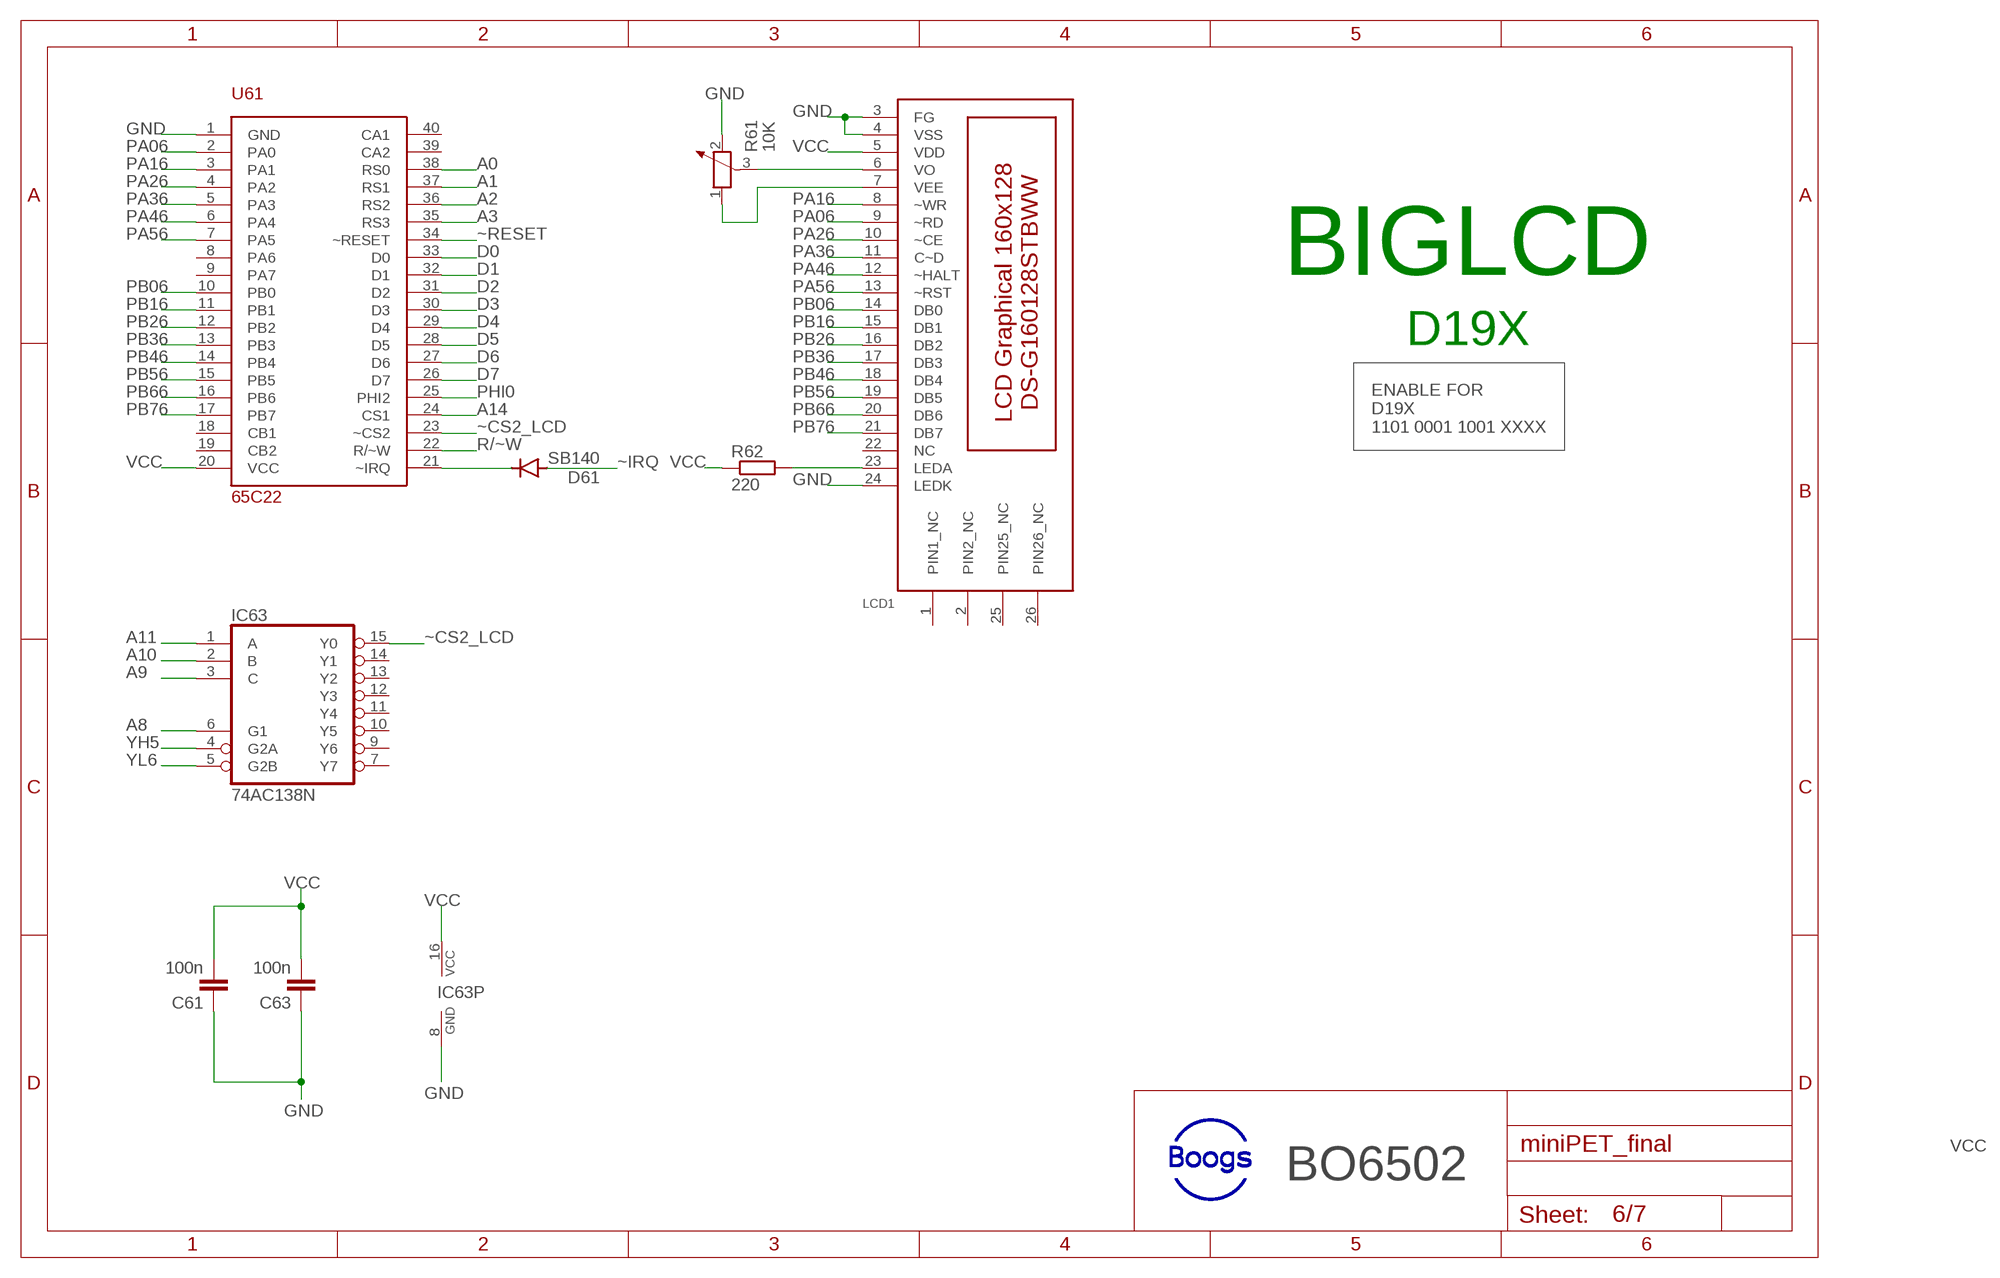
[diagram p5: schematic, sheet 6]

### Parts
C61  100n  C-EU025-025X050  [C025-025X050]
C63  100n  C-EU025-025X050  [C025-025X050]
D61  SB140  1N4004  [DO41-10]
IC63  74AC138N  [DIL16]
LCD1  DS-G160128STBWW  [PAK100/2500-26]
R61  10K  POTENTIOMETER_PT-10  [PT-10]
R62  220  R-EU_0207/10  [0207/10]
U61  65C22  [DIL40]

### Nets
A0: U61.38(RS0) ; also sheet 1,2,3,4,5,7
A1: U61.37(RS1) ; also sheet 1,2,3,4,5,7
A2: U61.36(RS2) ; also sheet 1,2,3,5,7
A3: U61.35(RS3) ; also sheet 1,2,3,5,7
A8: IC63.6(G1) ; also sheet 1,2,3,5,7
A9: IC63.3(C) ; also sheet 1,2,3,5,7
A10: IC63.2(B) ; also sheet 1,2,3,5,7
A11: IC63.1(A) ; also sheet 1,2,3,5,7
A14: U61.24(CS1) ; also sheet 1,2,3,4,5,7
D0: U61.33(D0) ; also sheet 1,2,3,4,5,7
D1: U61.32(D1) ; also sheet 1,2,3,4,5,7
D2: U61.31(D2) ; also sheet 1,2,3,4,5,7
D3: U61.30(D3) ; also sheet 1,2,3,4,5,7
D4: U61.29(D4) ; also sheet 1,2,3,4,5,7
D5: U61.28(D5) ; also sheet 1,2,3,4,5,7
D6: U61.27(D6) ; also sheet 1,2,3,4,5,7
D7: U61.26(D7) ; also sheet 1,2,3,4,5,7
GND: C61.1 C63.1 IC63.8(GND) LCD1.3(FG) LCD1.4(VSS) LCD1.24(LEDK) R61.2 U61.1(GND) ; also sheet 1,2,3,4,5,7
N$63: D61.C U61.21(~IRQ)
N$64: LCD1.6(VO) R61.3
N$65: LCD1.7(VEE) R61.1
N$66: LCD1.23(LEDA) R62.2
PA06: LCD1.9(~RD) U61.2(PA0)
PA16: LCD1.8(~WR) U61.3(PA1)
PA26: LCD1.10(~CE) U61.4(PA2)
PA36: LCD1.11(C~D) U61.5(PA3)
PA46: LCD1.12(~HALT) U61.6(PA4)
PA56: LCD1.13(~RST) U61.7(PA5)
PB06: LCD1.14(DB0) U61.10(PB0)
PB16: LCD1.15(DB1) U61.11(PB1)
PB26: LCD1.16(DB2) U61.12(PB2)
PB36: LCD1.17(DB3) U61.13(PB3)
PB46: LCD1.18(DB4) U61.14(PB4)
PB56: LCD1.19(DB5) U61.15(PB5)
PB66: LCD1.20(DB6) U61.16(PB6)
PB76: LCD1.21(DB7) U61.17(PB7)
PHI0: U61.25(PHI2) ; also sheet 1,2,4,5,7
R/~W: U61.22(R/~W) ; also sheet 1,2,4,5
VCC: C61.2 C63.2 IC63.16(VCC) LCD1.5(VDD) R62.1 U61.20(VCC) ; also sheet 1,2,3,4,5,7
YH5: IC63.4(G2A) ; also sheet 5
YL6: IC63.5(G2B) ; also sheet 5
~CS2_LCD: IC63.15(Y0) U61.23(~CS2)
~IRQ: D61.A ; also sheet 1,4,5
~RESET: U61.34(~RESET) ; also sheet 1,4,5
Unconnected: IC63.7(Y7) IC63.9(Y6) IC63.10(Y5) IC63.11(Y4) IC63.12(Y3) IC63.13(Y2) IC63.14(Y1) LCD1.1(PIN1_NC) LCD1.2(PIN2_NC) LCD1.22(NC) LCD1.25(PIN25_NC) LCD1.26(PIN26_NC) U61.8(PA6) U61.9(PA7) U61.18(CB1) U61.19(CB2) U61.39(CA2) U61.40(CA1)

### Notes on the sheet
- BIGLCD
- D19X
- ENABLE FOR
  D19X
  1101 0001 1001 XXXX
- BO6502

## Sheet 7 of 7
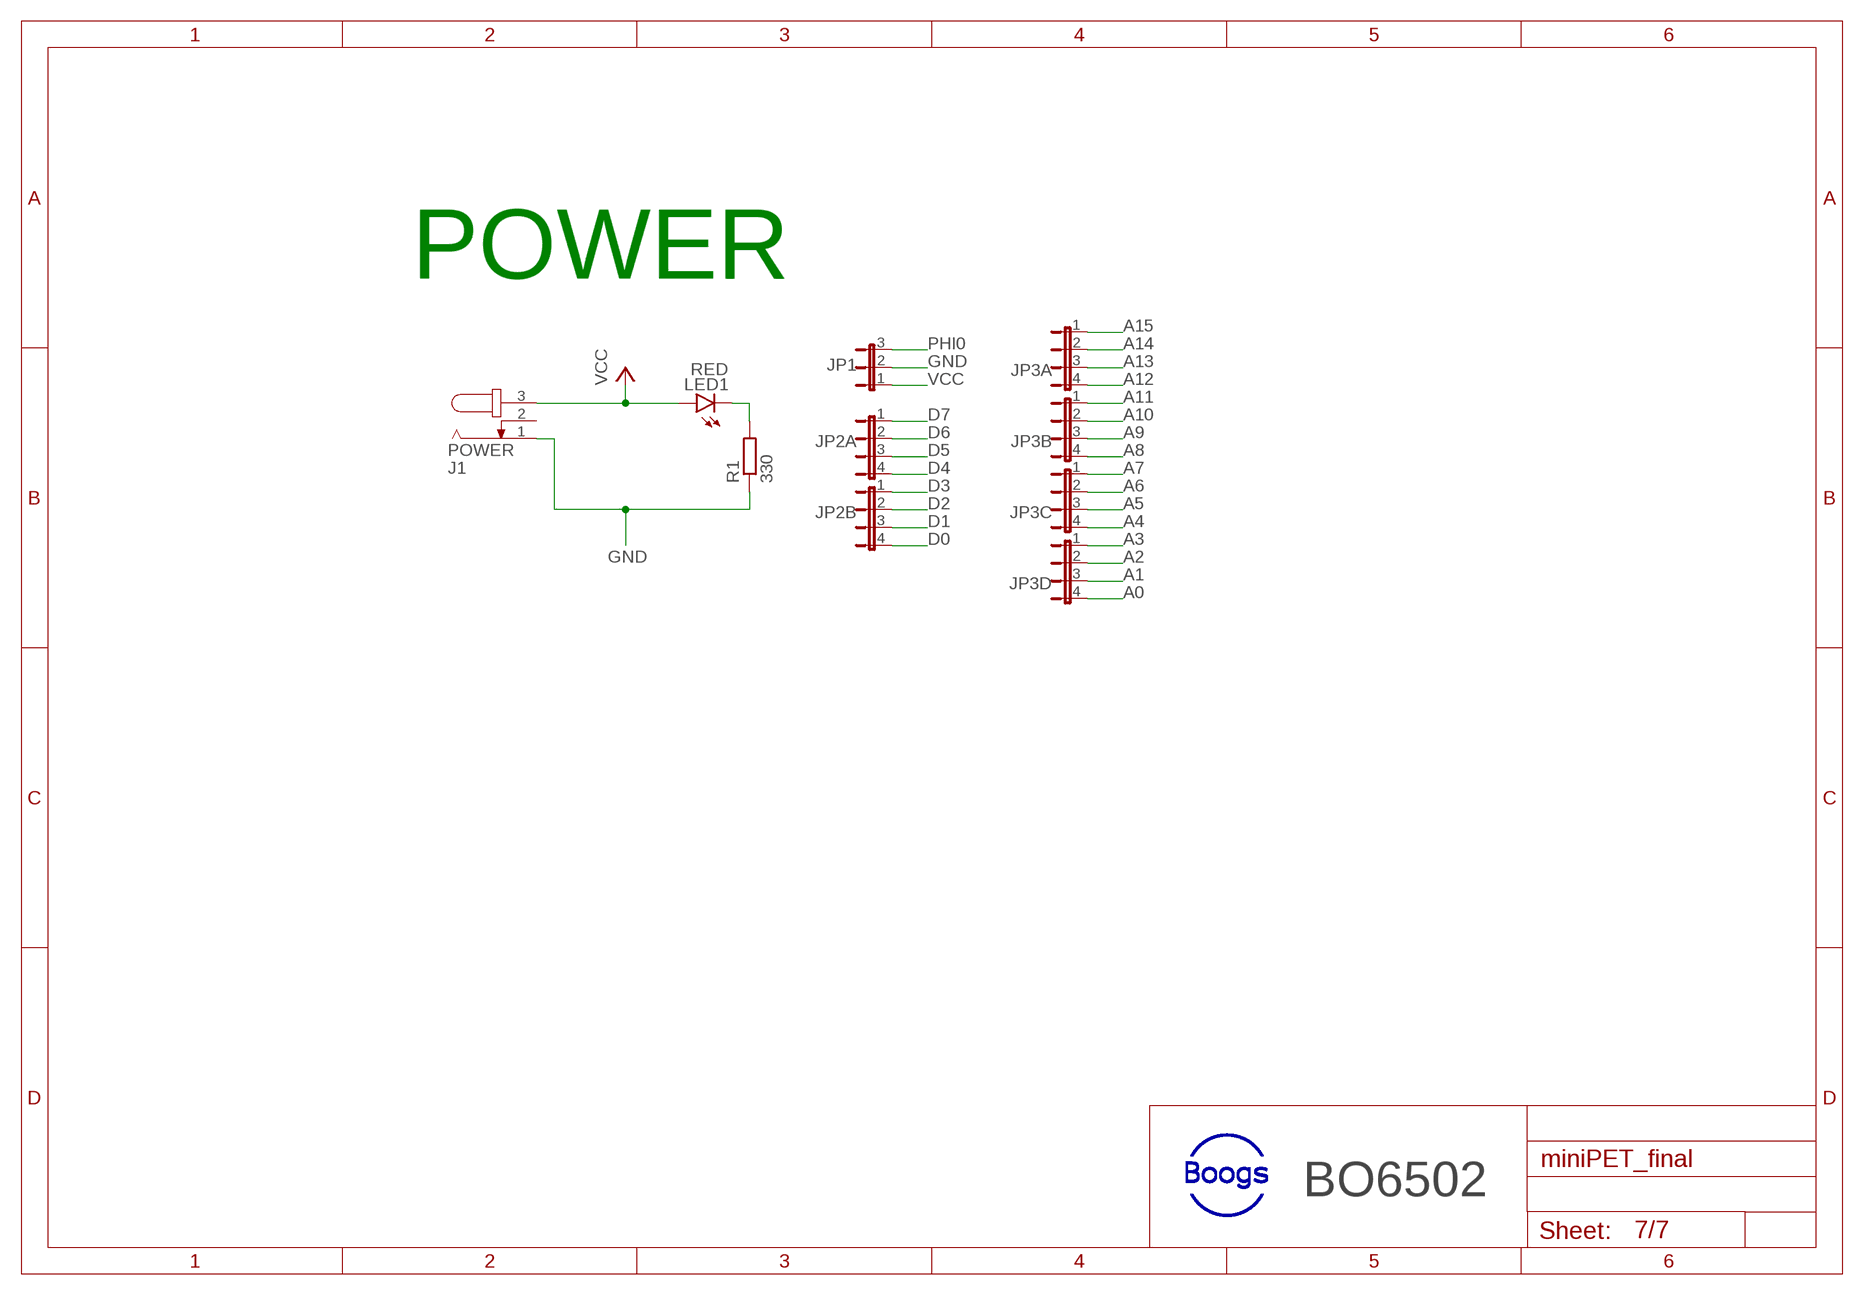
[diagram p6: schematic, sheet 7]

### Parts
J1  POWER  JACK-PLUG1  [SPC4078]
JP1  JP2E  [JP2]
JP2A  JP4E  [JP4]
JP2B  JP4E  [JP4]
JP3A  JP4E  [JP4]
JP3B  JP4E  [JP4]
JP3C  JP4E  [JP4]
JP3D  JP4E  [JP4]
LED1  RED  LED5MM  [LED5MM]
R1  330  R-EU_0207/10  [0207/10]

### Nets
A0: JP3D.4 ; also sheet 1,2,3,4,5,6
A1: JP3D.3 ; also sheet 1,2,3,4,5,6
A2: JP3D.2 ; also sheet 1,2,3,5,6
A3: JP3D.1 ; also sheet 1,2,3,5,6
A4: JP3C.4 ; also sheet 1,2,3,5
A5: JP3C.3 ; also sheet 1,2,3,5
A6: JP3C.2 ; also sheet 1,2,3,5
A7: JP3C.1 ; also sheet 1,2,3,5
A8: JP3B.4 ; also sheet 1,2,3,5,6
A9: JP3B.3 ; also sheet 1,2,3,5,6
A10: JP3B.2 ; also sheet 1,2,3,5,6
A11: JP3B.1 ; also sheet 1,2,3,5,6
A12: JP3A.4 ; also sheet 1,2,3,4,5
A13: JP3A.3 ; also sheet 1,2,3,4,5
A14: JP3A.2 ; also sheet 1,2,3,4,5,6
A15: JP3A.1 ; also sheet 1,2,3,4,5
D0: JP2B.4 ; also sheet 1,2,3,4,5,6
D1: JP2B.3 ; also sheet 1,2,3,4,5,6
D2: JP2B.2 ; also sheet 1,2,3,4,5,6
D3: JP2B.1 ; also sheet 1,2,3,4,5,6
D4: JP2A.4 ; also sheet 1,2,3,4,5,6
D5: JP2A.3 ; also sheet 1,2,3,4,5,6
D6: JP2A.2 ; also sheet 1,2,3,4,5,6
D7: JP2A.1 ; also sheet 1,2,3,4,5,6
GND: J1.1 JP1.2 R1.1 ; also sheet 1,2,3,4,5,6
N$4: LED1.K(C) R1.2
PHI0: JP1.3 ; also sheet 1,2,4,5,6
VCC: J1.3 JP1.1 LED1.A ; also sheet 1,2,3,4,5,6
Unconnected: J1.2

### Notes on the sheet
- POWER
- BO6502

## Library data of the parts
C11 C13-C15 C21-C25 C31-C34 C41-C48 C51-C57 C61 C63 = rcl:C-EU: CAPACITOR, European symbol; SPICEPREFIX: C
C12 = rcl:CPOL-EU: POLARIZED CAPACITOR, European symbol; SPICEPREFIX: C
D41 D51 D61 = diode:1N4004: DIODE general purpose rectifier, 1 A
D52 = diode:1N4148: DIODE high speed (Philips)
IC12 = st-microelectronics:NE555: General purpose bipolar Timer; MF: Arrow Electronics; MPN: NE555N; OC_FARNELL: 1467742; OC_NEWARK: 89K1486
IC13 = 74xx-eu:74*04: Hex INVERTER
IC21 = memory-hitachi:62256P: MEMORY; OC_FARNELL: unknown; OC_NEWARK: unknown
IC22 IC32 IC42 IC54-IC56 IC63 = 74xx-eu:74*138: 3-line to 8-line DECODER/DEMULTIPLEXER
IC23 IC24 IC33 IC34 = 74xx-eu:74*08: Quad 2-input AND gate
IC25 = 74xx-eu:74*00: Quad 2-input NAND gate
IC41 = maxim:MAX232: RS232 TRANSCEIVER; MF: MAXIM; MPN: MAX232ACPE+; OC_FARNELL: 9723773; OC_NEWARK: 68K4544
IC52 IC53 = 74xx-eu:74*595: 8-bit SHIFT REGISTER, output latch
IC57 = 74xx-eu:74*14: Hex schmitt trigger INVERTER
J1 = con-jack:JACK-PLUG: DC POWER JACK Power Jack, DC, Right Angle, Through Hole, Rated 5A at 16VDC, PC Terminals Distributor: Farnell (www.Farnell.de) Drawing: 84N1161.pdf / 84N1162.pdf Manufacturer: SPC Technology (www.spctechnology.com) Type: SPC4077 / SPC 4078; OC_FARNELL: unknown; OC_NEWARK: unknown
JP1 = jumper:JP2E: JUMPER
JP2A JP2B JP3A JP3B JP3C JP3D = jumper:JP4E: JUMPER
JP11-JP13 = jumper:JP1E: JUMPER
LCD1 = 65xx_family:DS-G160128STBWW
LED1 = led:LED: LED OSRAM: - CHIPLED LG R971, LG N971, LY N971, LG Q971, LY Q971, LO R971, LY R971 LH N974, LH R974 LS Q976, LO Q976, LY Q976 LO Q996 - Hyper CHIPLED LW Q18S LB Q993, LB Q99A, LB R99A - SideLED LS A670, LO A670, LY A670, LG A670, LP A670 LB A673, LV A673, LT A673, LW A673 LH A674 LY A675 LS A676, LA A676, LO A676, LY A676, LW A676 LS A679, LY A679, LG A679 - Hyper Micro SIDELED® LS Y876, LA Y876, LO Y876, LY Y876 LT Y87S - SmartLED LW L88C, LW L88S LB L89C, LB L89S, LG L890 LS L89K, LO L89K, LY L89K LS L896, LA L896, LO L896, LY L896 - TOPLED LS T670, LO T670, LY T670, LG T670, LP T670 LSG T670, LSP T670, LSY T670, LOP T670, LYG T670 LG T671, LOG T671, LSG T671 LB T673, LV T673, LT T673, LW T673 LH T674 LS T676, LA T676, LO T676, LY T676, LB T676, LH T676, LSB T676, LW T676 LB T67C, LV T67C, LT T67C, LS T67K, LO T67K, LY T67K, LW E67C LS E67B, LA E67B, LO E67B, LY E67B, LB E67C, LV E67C, LT E67C LW T67C LS T679, LY T679, LG T679 LS T770, LO T770, LY T770, LG T770, LP T770 LB T773, LV T773, LT T773, LW T773 LH T774 LS E675, LA E675, LY E675, LS T675 LS T776, LA T776, LO T776, LY T776, LB T776 LHGB T686 LT T68C, LB T68C - Hyper Mini TOPLED® LB M676 - Mini TOPLED Santana® LG M470 LS M47K, LO M47K, LY M47K Source: http://www.osram.convergy.de LUXEON: - LUMILED® LXK2-PW12-R00, LXK2-PW12-S00, LXK2-PW14-U00, LXK2-PW14-V00 LXK2-PM12-R00, LXK2-PM12-S00, LXK2-PM14-U00 LXK2-PE12-Q00, LXK2-PE12-R00, LXK2-PE12-S00, LXK2-PE14-T00, LXK2-PE14-U00 LXK2-PB12-K00, LXK2-PB12-L00, LXK2-PB12-M00, LXK2-PB14-N00, LXK2-PB14-P00, LXK2-PB14-Q00 LXK2-PR12-L00, LXK2-PR12-M00, LXK2-PR14-Q00, LXK2-PR14-R00 LXK2-PD12-Q00, LXK2-PD12-R00, LXK2-PD12-S00 LXK2-PH12-R00, LXK2-PH12-S00 LXK2-PL12-P00, LXK2-PL12-Q00, LXK2-PL12-R00 Source: www.luxeon.com KINGBRIGHT: KA-3528ASYC Source: www.kingbright.com
Q41 = crystal:CRYSTAL: CRYSTAL; OC_FARNELL: 1667008; OC_NEWARK: unknown
QG1 = crystal:XO-: CRYSTAL; OC_FARNELL: unknown; OC_NEWARK: unknown
R1 R11-R18 R31 R41 R51 R62 = rcl:R-EU_: RESISTOR, European symbol; SPICEPREFIX: R
R61 = rcl:POTENTIOMETER_: Potentiometer; SPICEMODEL: POT; SPICEPREFIX: X
SW1 = SparkFun-Switches:MOMENTARY-SWITCH-SPST: Momentary Switch (Pushbutton) - SPST Normally-open (NO) SPST momentary switches (buttons, pushbuttons). Variants PTH-12MM - 12mm square, through-hole Momentary Pushbutton Switch - 12mm Square <https://www.sparkfun.com/products/9190> (COM-09190) PTH-6.0MM, PTH-6.0MM-KIT - 6.0mm square, through-hole Mini Pushbutton Switch <https://www.sparkfun.com/products/97> (COM-00097) KIT package intended for soldering kit's - only one side of pads' copper is exposed. PTH-RIGHT-ANGLE-KIT - Right-angle, through-hole Right Angle Tactile Button <https://www.sparkfun.com/products/10791> - Used on SparkFun BigTime Watch Kit <https://www.sparkfun.com/products/11734> SMD-12MM - 12mm square, surface-mount Tactile Button - SMD (12mm) <https://www.sparkfun.com/products/12993> (COM-12993) Used on SparkFun PicoBoard <https://www.sparkfun.com/products/11888> SMD-4.5MM - 4.5mm Square Trackball Switch Used on SparkFun Blackberry Trackballer Breakout <https://www.sparkfun.com/products/13169> SMD-4.6MMX2.8MM - 4.60mm x 2.80mm, surface mount Used on SparkFun Pro Micro - RP2040 <https://www.sparkfun.com/products/17717> SMD-5.2MM, SMD-5.2-REDUNDANT - 5.2mm square, surface-mount Mini Pushbutton Switch - SMD <https://www.sparkfun.com/products/8720> (COM-08720) Used on Arduino Pro Mini <https://www.sparkfun.com/products/11114> REDUNDANT package connects both switch circuits together SMD-6.0X3.5MM - 6.0 x 3.5mm, surface mount Momentary Reset Switch SMD <https://www.sparkfun.com/products/8229> (COM-08229) SMD-6.2MM-TALL - 6.2mm square, surface mount Tactile Button - SMD (6mm) <https://www.sparkfun.com/products/12992> Used on SparkFun Digital Sandbox <https://www.sparkfun.com/products/12651> SMD-RIGHT-ANGLE - Right-angle, surface mount Used on SparkFun Block for Intel® Edison - Arduino <https://www.sparkfun.com/products/13036>; PROD_ID: SWCH-13896
U11 = 65xx_family:65C02
U43 = 65xx_family:65C51
U51 U61 = 65xx_family:65C22
X1 = con-subd:F09: SUB-D; OC_FARNELL: unknown; OC_NEWARK: unknown
X2 = con-hirschmann_mod:MAB5SH: Female CONNECTOR 5 pins 90 deg. with shield, horizontal (DIN 41524); OC_FARNELL: 809883; OC_NEWARK: unknown
ZX1-28C256 = con-3m:228-?00-0602J: Zero Insertion Force Socked Source: http://www.3M.com/ehpd; MF: 3M; MPN: 228-1277-00-0602J; OC_FARNELL: 9897356; OC_NEWARK: 85K7825